# EAGLE design links_v01 (EAGLE 5.09)
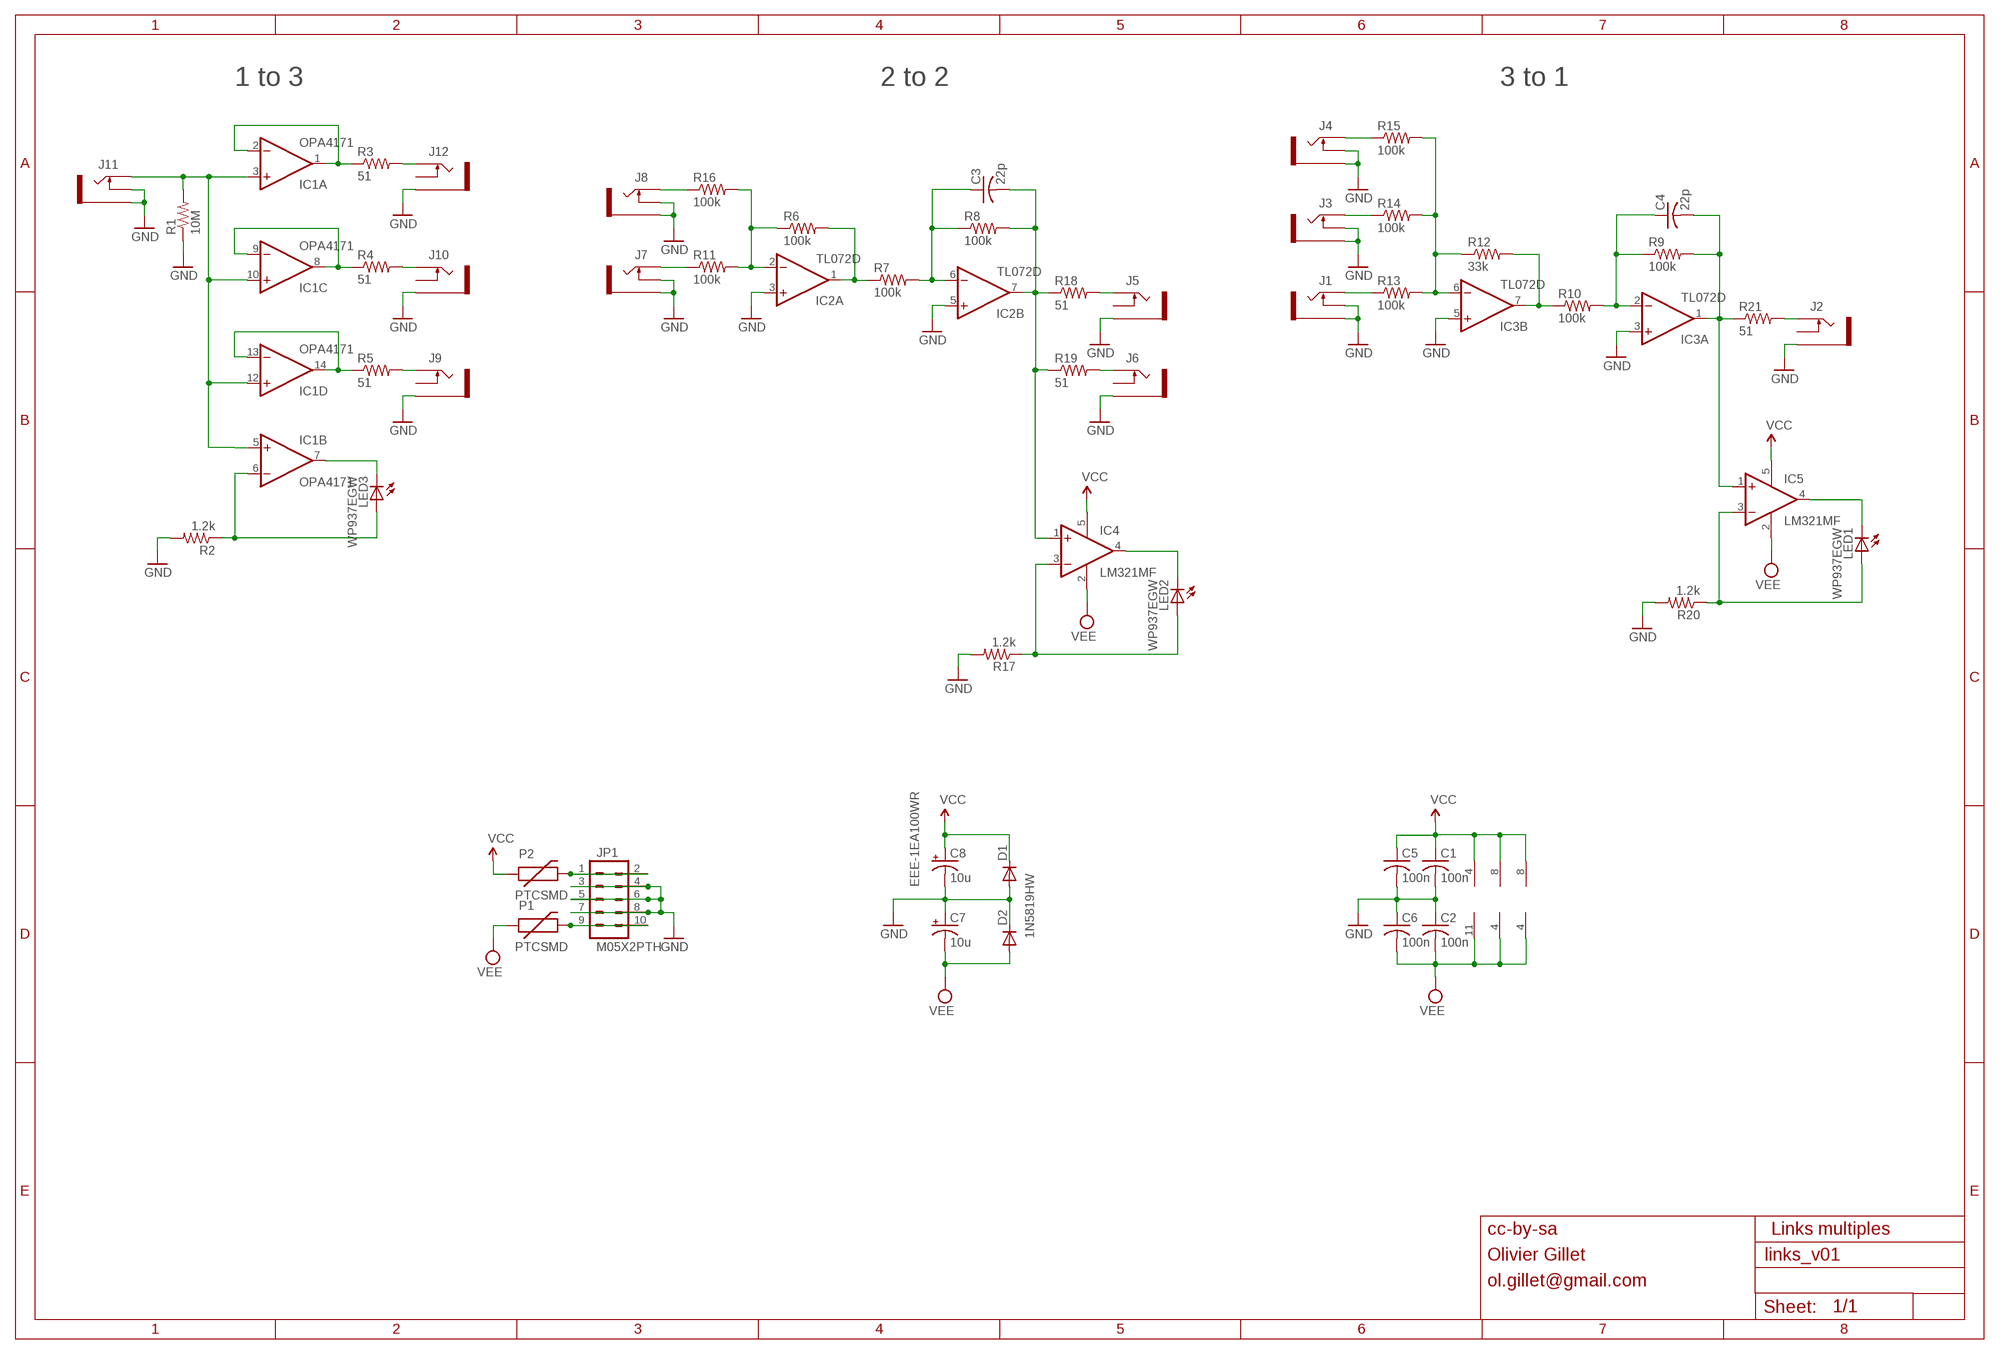
[diagram p0: schematic, sheet 1]

## Parts
C1  100n  C-USC0603  [C0603]
C2  100n  C-USC0603  [C0603]
C3  22p  C-USC0603  [C0603]
C4  22p  C-USC0603  [C0603]
C5  100n  C-USC0603  [C0603]
C6  100n  C-USC0603  [C0603]
C7  10u  CPOL-USA  [PANASONIC_A]
C8  10u  CPOL-USA  [PANASONIC_A]
D1  1N5819HW  DIODE-SOD123  [SOD123]
D2  1N5819HW  DIODE-SOD123  [SOD123]
IC1  OPA4171  TL074D  [SO14]
IC2  TL072D  [SO08]
IC3  TL072D  [SO08]
IC4  LM321MF  [SOT23-5]
IC5  LM321MF  [SOT23-5]
J1  1502_03304  [WQP_PJ_304]
J2  1502_03304  [WQP_PJ_304]
J3  1502_03304  [WQP_PJ_304]
J4  1502_03304  [WQP_PJ_304]
J5  1502_03304  [WQP_PJ_304]
J6  1502_03304  [WQP_PJ_304]
J7  1502_03304  [WQP_PJ_304]
J8  1502_03304  [WQP_PJ_304]
J9  1502_03304  [WQP_PJ_304]
J10  1502_03304  [WQP_PJ_304]
J11  1502_03304  [WQP_PJ_304]
J12  1502_03304  [WQP_PJ_304]
JP1  M05X2PTH  [AVR_ICSP]
LED1  WP937EGW  LED3MM  [LED3MM]
LED2  WP937EGW  LED3MM  [LED3MM]
LED3  WP937EGW  LED3MM  [LED3MM]
P1  PTCSMD  [PTC-1206]
P2  PTCSMD  [PTC-1206]
R1  10M  R-US_R0603  [R0603]
R2  1.2k  R-US_R0603  [R0603]
R3  51  R-US_R0603  [R0603]
R4  51  R-US_R0603  [R0603]
R5  51  R-US_R0603  [R0603]
R6  100k  R-US_R0603  [R0603]
R7  100k  R-US_R0603  [R0603]
R8  100k  R-US_R0603  [R0603]
R9  100k  R-US_R0603  [R0603]
R10  100k  R-US_R0603  [R0603]
R11  100k  R-US_R0603  [R0603]
R12  33k  R-US_R0603  [R0603]
R13  100k  R-US_R0603  [R0603]
R14  100k  R-US_R0603  [R0603]
R15  100k  R-US_R0603  [R0603]
R16  100k  R-US_R0603  [R0603]
R17  1.2k  R-US_R0603  [R0603]
R18  51  R-US_R0603  [R0603]
R19  51  R-US_R0603  [R0603]
R20  1.2k  R-US_R0603  [R0603]
R21  51  R-US_R0603  [R0603]

## Nets
GND: C1.2 C2.1 C5.2 C6.1 C7.+ C8.- D1.A D2.C IC2.3(A:+IN) IC2.5(B:+IN) IC3.3(A:+IN) IC3.5(B:+IN) J1.GND J1.SW J2.GND J3.GND J3.SW J4.GND J4.SW J5.GND J6.GND J7.GND J7.SW J8.GND J8.SW J9.GND J10.GND J11.GND J11.SW J12.GND JP1.3 JP1.4 JP1.5 JP1.6 JP1.7 JP1.8 R1.1 R2.2 R17.2 R20.2
N$1: IC2.1(A:OUT) R6.2 R7.1
N$2: J1.SIGNAL R13.1
N$3: IC1.1(A:OUT) IC1.2(A:-IN) R3.1
N$4: IC1.8(C:OUT) IC1.9(C:-IN) R4.1
N$5: IC1.13(D:-IN) IC1.14(D:OUT) R5.1
N$6: JP1.1 JP1.2 P2.2
N$7: IC1.3(A:+IN) IC1.5(B:+IN) IC1.10(C:+IN) IC1.12(D:+IN) J11.SIGNAL R1.2
N$8: IC1.7(B:OUT) LED3.K(C)
N$9: J3.SIGNAL R14.1
N$10: J7.SIGNAL R11.1
N$11: J12.SIGNAL R3.2
N$12: J10.SIGNAL R4.2
N$13: J9.SIGNAL R5.2
N$14: IC4.4(OUT) LED2.K(C)
N$15: J8.SIGNAL R16.1
N$16: J6.SIGNAL R19.2
N$17: J5.SIGNAL R18.2
N$18: C4.2 IC3.1(A:OUT) IC5.1(+IN) R9.2 R21.1
N$19: IC5.3(-IN) LED1.A R20.1
N$20: JP1.9 JP1.10 P1.2
N$21: IC1.6(B:-IN) LED3.A R2.1
N$22: J4.SIGNAL R15.1
N$23: J2.SIGNAL R21.2
N$24: IC3.6(B:-IN) R12.1 R13.2 R14.2 R15.2
N$25: IC3.7(B:OUT) R10.1 R12.2
N$26: C3.2 IC2.7(B:OUT) IC4.1(+IN) R8.2 R18.1 R19.1
N$27: C4.1 IC3.2(A:-IN) R9.1 R10.2
N$29: IC4.3(-IN) LED2.A R17.1
N$30: IC5.4(OUT) LED1.K(C)
N$31: IC2.2(A:-IN) R6.1 R11.2 R16.2
N$32: C3.1 IC2.6(B:-IN) R7.2 R8.1
VCC: C1.1 C5.1 C8.+ D1.C IC1.4(P:V+) IC2.8(P:V+) IC3.8(P:V+) IC4.5(V+) IC5.5(V+) P2.1
VEE: C2.2 C6.2 C7.- D2.A IC1.11(P:V-) IC2.4(P:V-) IC3.4(P:V-) IC4.2(V-) IC5.2(V-) P1.1
Unconnected: J2.SW J5.SW J6.SW J9.SW J10.SW J12.SW

## Notes on the sheet
- 1 to 3 | 2 to 2 | 3 to 1
- EEE-1EA100WR
- cc-by-sa | Links multiples
- Olivier Gillet
- ol.gillet@gmail.com

## Library data of the parts
C1-C6 = rcl:C-US: CAPACITOR, American symbol
C7 C8 = rcl:CPOL-US: POLARIZED CAPACITOR, American symbol
D1 D2 = diode:DIODE-: DIODE
IC1 = gm-ics:TL074: OP AMP
IC2 IC3 = linear:TL072: OP AMP
IC4 IC5 = linear:LM321?*: Low Power Single Op Amp Source: http://cache.national.com/ds/LM/LM321.pdf
J1-J12 = og-lumberg:1502_03
JP1 = og-header:M05X2: Header 5x2 Standard 10-pin dual row 0.1" header. Commonly used with AVR-ISP. Use with Spark Fun Electronics SKU: PRT-00778
LED1-LED3 = led:LED: LED OSRAM: - CHIPLED LG R971, LG N971, LY N971, LG Q971, LY Q971, LO R971, LY R971 LH N974, LH R974 LS Q976, LO Q976, LY Q976 LO Q996 - Hyper CHIPLED LW Q18S LB Q993, LB Q99A, LB R99A - SideLED LS A670, LO A670, LY A670, LG A670, LP A670 LB A673, LV A673, LT A673, LW A673 LH A674 LY A675 LS A676, LA A676, LO A676, LY A676, LW A676 LS A679, LY A679, LG A679 - Hyper Micro SIDELED® LS Y876, LA Y876, LO Y876, LY Y876 LT Y87S - SmartLED LW L88C, LW L88S LB L89C, LB L89S, LG L890 LS L89K, LO L89K, LY L89K LS L896, LA L896, LO L896, LY L896 - TOPLED LS T670, LO T670, LY T670, LG T670, LP T670 LSG T670, LSP T670, LSY T670, LOP T670, LYG T670 LG T671, LOG T671, LSG T671 LB T673, LV T673, LT T673, LW T673 LH T674 LS T676, LA T676, LO T676, LY T676, LB T676, LH T676, LSB T676, LW T676 LB T67C, LV T67C, LT T67C, LS T67K, LO T67K, LY T67K, LW E67C LS E67B, LA E67B, LO E67B, LY E67B, LB E67C, LV E67C, LT E67C LW T67C LS T679, LY T679, LG T679 LS T770, LO T770, LY T770, LG T770, LP T770 LB T773, LV T773, LT T773, LW T773 LH T774 LS E675, LA E675, LY E675, LS T675 LS T776, LA T776, LO T776, LY T776, LB T776 LHGB T686 LT T68C, LB T68C - Hyper Mini TOPLED® LB M676 - Mini TOPLED Santana® LG M470 LS M47K, LO M47K, LY M47K Source: http://www.osram.convergy.de LUXEON: - LUMILED® LXK2-PW12-R00, LXK2-PW12-S00, LXK2-PW14-U00, LXK2-PW14-V00 LXK2-PM12-R00, LXK2-PM12-S00, LXK2-PM14-U00 LXK2-PE12-Q00, LXK2-PE12-R00, LXK2-PE12-S00, LXK2-PE14-T00, LXK2-PE14-U00 LXK2-PB12-K00, LXK2-PB12-L00, LXK2-PB12-M00, LXK2-PB14-N00, LXK2-PB14-P00, LXK2-PB14-Q00 LXK2-PR12-L00, LXK2-PR12-M00, LXK2-PR14-Q00, LXK2-PR14-R00 LXK2-PD12-Q00, LXK2-PD12-R00, LXK2-PD12-S00 LXK2-PH12-R00, LXK2-PH12-S00 LXK2-PL12-P00, LXK2-PL12-Q00, LXK2-PL12-R00 Source: www.luxeon.com KINGBRIGHT: KA-3528ASYC Source: www.kingbright.com
P1 P2 = SparkFun:PTC: Resettable Fuse PTC Resettable Fuse. Spark Fun Electronics SKU : COM-08357
R1-R21 = rcl:R-US_: RESISTOR, American symbol

## Board
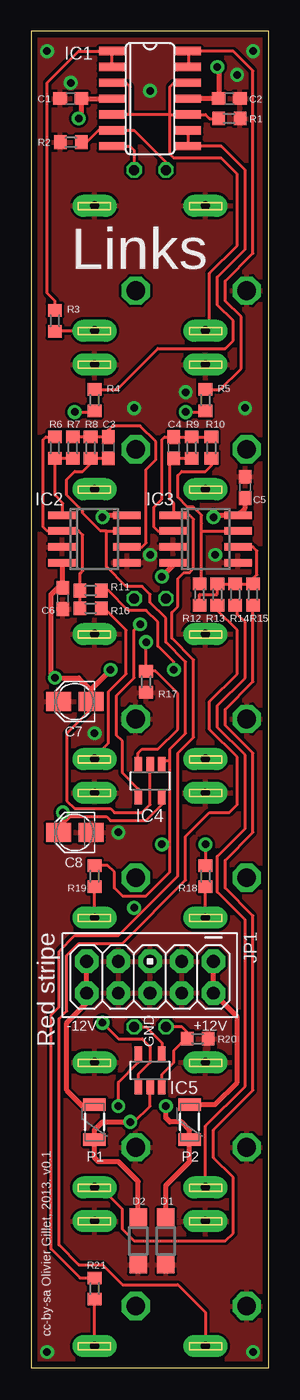
[diagram p1: board, top side]
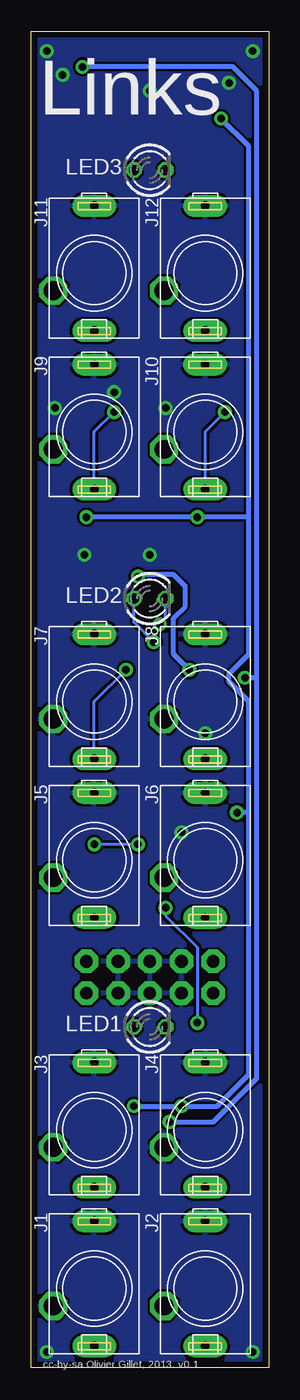
[diagram p2: board, bottom side, seen from below]

Size 19.03 x 107 mm. Coordinates in mm from the lower left corner, seen from the top.
Outline: 0,0 19.03,0 19.03,107 0,107 0,0
Copper layers (1*16): Top 0.035mm / dielectric 1.5mm / Bottom 0.035mm
Design rules "PCBCart-Standard *": minimum track width 8mil, minimum drill 0.4mm, track to track 8mil, track to pad 8mil, pad to pad 8mil, via to via 8mil, smd to smd 8mil, copper to edge 20mil, drill to drill 8mil, minimum pad ring 8mil, minimum via ring 10mil, stop-mask expansion 3mil, vias tented up to drill 0mil, thermal gap 8mil

### Footprints (pad centres in the part's own frame; a part is rotated, then mirrored left to right if it is on the bottom)
C0603 = smd 1.1 x 1: 1 -0.85,0; 2 0.85,0
PANASONIC_A = smd 2 x 1.5: + 1.3,0; - -1.3,0
SOD123 = smd 1.4 x 1.4: A 1.9,0; C -1.9,0
SO14 = smd 0.66 x 2.032: 1 -3.81,-3.073; 2 -2.54,-3.073; 3 -1.27,-3.073; 4 0,-3.073; 5 1.27,-3.073; 6 2.54,-3.073; 7 3.81,-3.073; 8 3.81,3.073; 9 2.54,3.073; 10 1.27,3.073; 11 0,3.073; 12 -1.27,3.073; 13 -2.54,3.073; 14 -3.81,3.073
SO08 = smd 0.6 x 2.2: 1 -1.905,-2.6; 2 -0.635,-2.6; 3 0.635,-2.6; 4 1.905,-2.6; 5 1.905,2.6; 6 0.635,2.6; 7 -0.635,2.6; 8 -1.905,2.6
SOT23-5 = smd 0.6 x 1.2: 1 -0.95,-1.306; 2 0,-1.306; 3 0.95,-1.306; 4 0.95,1.306; 5 -0.95,1.306
WQP_PJ_304 = drill 0.7 pad 1.778 long: GND 0,5.4; SIGNAL 0,-4.6 | drill 1.5 pad 1.93 octagon: SW -3.3,-1.4
AVR_ICSP = drill 1.016 pad 1.88 octagon: 1 -1.27,5.08; 2 1.27,5.08; 3 -1.27,2.54; 4 1.27,2.54; 5 -1.27,0; 6 1.27,0; 7 -1.27,-2.54; 8 1.27,-2.54; 9 -1.27,-5.08; 10 1.27,-5.08
LED3MM = drill 0.813 octagon: A -1.27,0; K 1.27,0
PTC-1206 = smd 1 x 1.8: 1 -1.4,0; 2 1.4,0
R0603 = smd 1 x 1.1: 1 -0.85,0; 2 0.85,0

### Placement (x,y rotation side)
C1  3.17,101.6 180 top
C2  15.88,101.6 180 top
C3  6.19,73.66 270 top
C4  11.43,73.66 270 top
C5  17.14,70.48 90 top
C6  2.54,61.59 90 top
C7  3.49,53.34 180 top
C8  3.49,42.86 180 top
D1  10.8,10.16 270 top
D2  8.57,10.16 90 top
IC1  9.53,101.6 270 top
IC2  5.08,66.36 270 top
IC3  13.97,66.36 270 top
IC4  9.53,46.99 180 top
IC5  9.53,23.81 0 top
J1  13.97,6.35 0 bottom
J2  5.08,6.35 0 bottom
J3  13.97,19.05 0 bottom
J4  5.08,19.05 0 bottom
J5  13.97,40.64 0 bottom
J6  5.08,40.64 0 bottom
J7  13.97,53.34 0 bottom
J8  5.08,53.34 0 bottom
J9  13.97,74.93 0 bottom
J10  5.08,74.93 0 bottom
J11  13.97,87.63 0 bottom
J12  5.08,87.63 0 bottom
JP1  9.53,31.27 270 top
LED1  9.53,27.3 0 bottom
LED2  9.53,61.59 0 bottom
LED3  9.53,95.89 0 bottom
P1  5.08,19.68 90 top
P2  12.7,19.68 90 top
R1  15.88,100.01 180 top
R2  3.17,98.11 180 top
R3  1.91,83.82 270 top
R4  5.08,77.47 270 top
R5  13.97,77.47 270 top
R6  1.91,73.66 270 top
R7  3.33,73.66 90 top
R8  4.76,73.66 270 top
R9  12.86,73.66 270 top
R10  14.45,73.66 90 top
R11  4.76,62.23 180 top
R12  13.49,61.91 90 top
R13  14.92,61.91 90 top
R14  16.35,61.91 90 top
R15  17.78,61.91 90 top
R16  4.76,60.8 180 top
R17  9.21,54.93 270 top
R18  13.97,39.37 270 top
R19  5.08,39.37 270 top
R20  13.34,26.35 0 top
R21  5.08,6.35 270 top
U$1  [EURORACK_TEMPLATE]  -0.64,117.47 0 top  (outside the outline)

### Tracks (layer width: path | path; a pad name or v marks a point on that pad's centre or on a via)
GND  (via drill 0.6)
  Top 0.254: C5.2 16.88,71.6
  other vias: 3.17,102.87 12.38,78.11 8.26,76.83 16.51,103.5 9.53,102.23 17.14,76.83 5.08,50.8 6.99,42.86 9.53,65.09 14.76,65.09 1.27,105.41 17.78,105.41 1.27,1.27 17.78,1.27
  pour Bottom: 0,107 0,0 19.05,0 19.05,107
  pour Top: 0,107 0,0 19.05,0 19.05,107
N$1
  Top 0.254: IC2.1 2.54,68.26 2.54,69.22 1.91,69.85 R6.2 R7.1
N$2
  Top 0.254: R13.1 14.92,60.64 16.51,59.05 16.51,55.56 14.29,53.34 14.29,51.12 16.51,48.9 16.51,45.09 15.88,44.45 14.29,44.45 12.38,42.55 12.38,39.05 7.3,33.97 3.81,33.97 2.86,33.02 2.86,28.57 2.22,27.94 2.22,9.84 3.81,8.26 5.71,8.26 7.3,6.67 11.75,6.67 13.97,4.45 J1.SIGNAL
N$3
  Top 0.254: IC1.2 IC1.1 3.81,105.41 1.27,102.87 1.27,86.04 1.91,85.41 R3.1
N$4
  Top 0.254: IC1.9 IC1.8 15.24,97.79 17.14,95.89 17.14,89.53 14.92,87.31 14.92,85.09 16.19,83.82 16.19,82.23 15.56,81.6 10.16,81.6 6.88,78.32 R4.1
N$5
  Top 0.254: IC1.13 IC1.14 16.19,105.41 17.78,103.82 17.78,89.22 15.56,87 15.56,85.41 16.83,84.14 16.83,80.01 15.14,78.32 R5.1
N$6
  Top 0.406: JP1.1 JP1.2 16.51,28.1 16.51,22.86 14.73,21.09 P2.2
N$7
  Top 0.254: R1.2 14.29,100.01 13.97,100.33 IC1.10 11.11,100.33 | 11.11,100.33 7.94,100.33 | IC1.3 7.62,102.87 7.94,102.55 7.94,100.33 | 11.11,100.33 11.11,102.55 11.43,102.87 IC1.12 | J11.SIGNAL 14.29,83.35 14.29,87.63 16.51,89.85 16.51,95.57 15.24,96.84 11.43,96.84 11.11,97.16 11.11,100.33 | 7.94,100.33 IC1.5
N$8
  Top 0.254: LED3.K 8.26,97.47 7.94,97.79 IC1.7
N$9
  Top 0.254: R14.1 16.51,60.9 16.51,60.33 17.14,59.69 17.14,55.24 14.92,53.02 14.92,51.28 17.14,49.05 17.14,43.18 14.92,40.96 14.92,38.1 17.14,35.88 17.14,22.54 13.97,19.37 J3.SIGNAL
N$10  (via drill 0.6)
  Top 0.254: 5.61,62.02 R11.1 6.19,62.23 7.78,60.64 9.21,60.64 10.16,59.69 10.16,57.78 11.43,56.52 v11.43,55.88
  Bottom 0.254: J7.SIGNAL 13.97,53.34 v11.43,55.88
N$11
  Top 0.254: R3.2 1.97,83.03 J12.SIGNAL
N$12  (via drill 0.6)
  Top 0.254: R4.2 4.98,76.52 v3.49,76.52
  Bottom 0.254: v3.49,76.52 5.08,74.93 J10.SIGNAL
N$13  (via drill 0.6)
  Top 0.254: R5.2 13.87,76.52 v12.38,76.52
  Bottom 0.254: v12.38,76.52 13.97,74.93 J9.SIGNAL
N$14  (via drill 0.6)
  Top 0.254: IC4.4 8.57,46.35 7.3,47.62 7.3,50.16 6.83,50.64 6.83,53.82 8.26,55.24 8.26,59.05 v8.73,59.53
  Bottom 0.254: v8.73,59.53 8.26,60.01 LED2.K
N$15
  Top 0.254: R16.1 5.87,60.8 7.62,59.05 7.62,55.56 6.19,54.13 6.19,50.01 5.08,48.9 J8.SIGNAL
N$16
  Top 0.254: J6.SIGNAL R19.2
N$17
  Top 0.254: J5.SIGNAL R18.2
N$18  (via drill 0.6)
  Top 0.254: R21.1 3.91,7.2 1.59,9.53 1.59,28.26 2.22,28.89 2.22,33.34 3.49,34.61 6.99,34.61 8.73,36.35 | R9.2 C4.2 11.43,72.71 11.11,72.39 11.11,69.53 11.43,69.22 11.43,68.32 IC3.1 12.7,68.26 13.02,67.94 13.02,63.98 12.7,63.66 12.22,63.66 11.75,63.18 11.75,60.96 11.27,60.48 11.27,58.42 13.02,56.67 13.02,50.48 11.75,49.21 11.75,39.37 8.73,36.35 | 8.73,36.35 v8.26,36.83 | 8.73,36.35 | v5.71,27.62 6.99,26.35 8.89,26.35 9.53,25.72 9.53,24.45 8.57,23.5 IC5.1
  Bottom 0.254: v5.71,27.62 5.71,33.66 8.26,36.2 v8.26,36.83
N$19
  Top 0.254: LED1.A 12.06,27.3 12.48,26.89 R20.1 12.38,26.35 11.43,25.4 11.43,24.45 10.47,23.49 IC5.3
N$20
  Top 0.406: P1.2 4.95,20.95 4.13,20.95 2.86,22.23 2.86,27.62 4.45,29.21 JP1.10 JP1.9
N$21
  Top 0.254: LED3.A 10.79,96.52 8.26,99.06 IC1.6 5.4,99.06 4.45,98.11 R2.1
N$22
  Top 0.254: R15.1 17.78,54.93 15.56,52.7 15.56,51.44 17.78,49.21 17.78,42.86 15.56,40.64 15.56,38.42 17.78,36.2 17.78,22.23 14.61,19.05 14.61,16.83 16.19,15.24 16.19,10.79 15.56,10.16 8.26,10.16 7.3,11.11 7.3,12.7 5.55,14.45 J4.SIGNAL
N$23
  Top 0.254: J2.SIGNAL R21.2
N$24
  Top 0.254: IC3.6 17.78,65.72 18.1,65.41 18.1,63.5 17.78,63.18 R15.2 R14.2 R13.2 14.92,61.91 13.49,61.91 R12.1
N$25
  Top 0.254: 13.65,66.99 13.65,63.02 13.49,62.87 R12.2 | 13.65,66.99 13.65,67.63 13.65,68.26 13.02,68.9 12.54,68.9 11.75,69.69 11.75,71.44 12.06,71.75 13.97,71.75 14.45,72.23 R10.1 | 13.65,66.99 IC3.7
N$26  (via drill 0.6)
  Top 0.254: 6.03,66.99 IC2.7 | 6.03,66.99 6.03,64.14 7.62,62.55 8.89,62.55 9.53,61.91 9.53,61.28 10.79,60.01 10.79,58.1 12.38,56.52 12.38,50.8 11.11,49.53 11.11,48.58 | 6.03,66.99 5.56,66.99 4.76,67.79 4.13,68.42 4.13,68.58 2.86,69.85 2.86,71.12 3.49,71.75 4.13,71.75 4.76,72.39 R8.2 C3.2 | v13.97,41.91 R18.1 | 5.18,40.32 R19.1 6.13,40.22 6.67,39.69 6.67,38.42 7.3,37.78 9.21,37.78 11.11,39.69 11.11,41.91 | 11.11,41.91 v10.48,41.91 | 11.11,41.91 11.11,48.58 | IC4.1 10.76,48.58 11.11,48.58
  Bottom 0.254: v10.48,41.91 v13.97,41.91
N$27
  Top 0.254: IC3.2 10.16,66.99 9.84,67.31 9.84,68.9 10.48,69.53 10.48,74.3 10.69,74.51 C4.1 R9.1 R10.2
N$29  (via drill 0.6)
  Top 0.254: IC4.3 8.57,49.21 8.89,49.53 10.16,49.53 11.75,51.12 11.75,53.98 9.95,55.78 R17.1 v9.21,58.1
  Bottom 0.254: v9.21,58.1 10.79,59.69 LED2.A
N$30
  Top 0.254: LED1.K 9.21,27.3 10.47,26.04 IC5.4
N$31
  Top 0.254: R16.2 R11.2 3.91,63.6 4.13,63.82 4.13,66.67 3.81,66.99 IC2.2 1.27,66.99 0.95,67.31 0.95,74.3 1.17,74.51 R6.1
N$32
  Top 0.254: IC2.6 8.89,65.72 9.21,66.04 9.21,71.91 10,72.71 10,74.14 8.73,75.41 6.51,75.41 6.19,75.09 C3.1 | R7.2 R8.1 C3.1 | C3.1
VCC  (via drill 0.6)
  Top 0.254: IC4.5 10.48,45.09 9.21,43.81 6.35,43.81 6.03,44.13 3.17,44.13 2.19,43.15 C8.+ | IC5.5 8.57,24.45 6.99,22.86 v6.99,20.95
  Top 0.406: D1.C | D1.C 10.79,14.61 12.7,16.51 P2.1 | P2.1 | P2.1 12.7,19.05 12.06,19.68 11.11,19.68 10.79,20 v10.79,20.95 | IC1.4 C1.1 4.03,100.23 v3.81,100.01 | C5.1 17.14,68.84 IC3.8 14.76,68.26 v14.61,68.1 | v5.71,68.1 5.87,68.26 IC2.8 | C8.+ 2.54,43.21 v2.54,44.45
  Bottom 0.406: v10.79,20.95 v6.99,20.95 4.13,20.95 1.59,23.5 1.59,44.45 | 1.59,44.45 1.59,53.34 3.17,54.93 3.17,55.56 1.59,57.15 1.59,68.1 | v14.61,68.1 v5.71,68.1 1.59,68.1 | 1.59,68.1 1.59,97.79 v3.81,100.01 | 1.59,44.45 v2.54,44.45
VEE  (via drill 0.6)
  Top 0.254: C7.- 4.79,52.73 2.86,50.8 2.86,45.4 3.49,44.77 6.35,44.77 6.67,44.45 8.89,44.45 9.53,45.09 IC4.2 | v7.94,19.68 8.26,19.68 9.53,20.95 IC5.2
  Top 0.406: D2.A 8.57,14.92 6.99,16.51 5.4,16.51 5.08,16.83 P1.1 5.08,19.05 5.71,19.68 v7.94,19.68 | 2.22,64.45 IC2.4 2.54,64.39 C6.2 2.12,62.45 1.59,61.91 1.59,55.56 v1.91,55.24 3.81,55.24 4.76,54.29 4.76,53.37 C7.- 4.79,54.32 v6.35,55.88 | IC1.11 C2.2 15.03,104.04 v14.92,104.14 | 11.43,64.39 IC3.4 11.37,64.23 v10.48,63.34
  Bottom 0.406: 0.95,55.24 0.95,23.18 4.45,19.68 v7.94,19.68 | 0.95,55.24 0.95,102.23 2.86,104.14 v14.92,104.14 | 0.95,55.24 v1.91,55.24 | v10.48,63.34 10.32,63.5 7.62,63.5 6.67,62.55 6.67,60.96 7.62,60.01 7.62,57.15 v6.35,55.88

### Text on the board
tPlace: -12V | +12V | Red stripe | GND
tNames: Links | cc-by-sa Olivier Gillet, 2013. v0.1
bNames: Links | cc-by-sa Olivier Gillet, 2013. v0.1